# Altium project Pulp FMC Sensor Board_8X512Mbits_HyperRam.PrjPcb
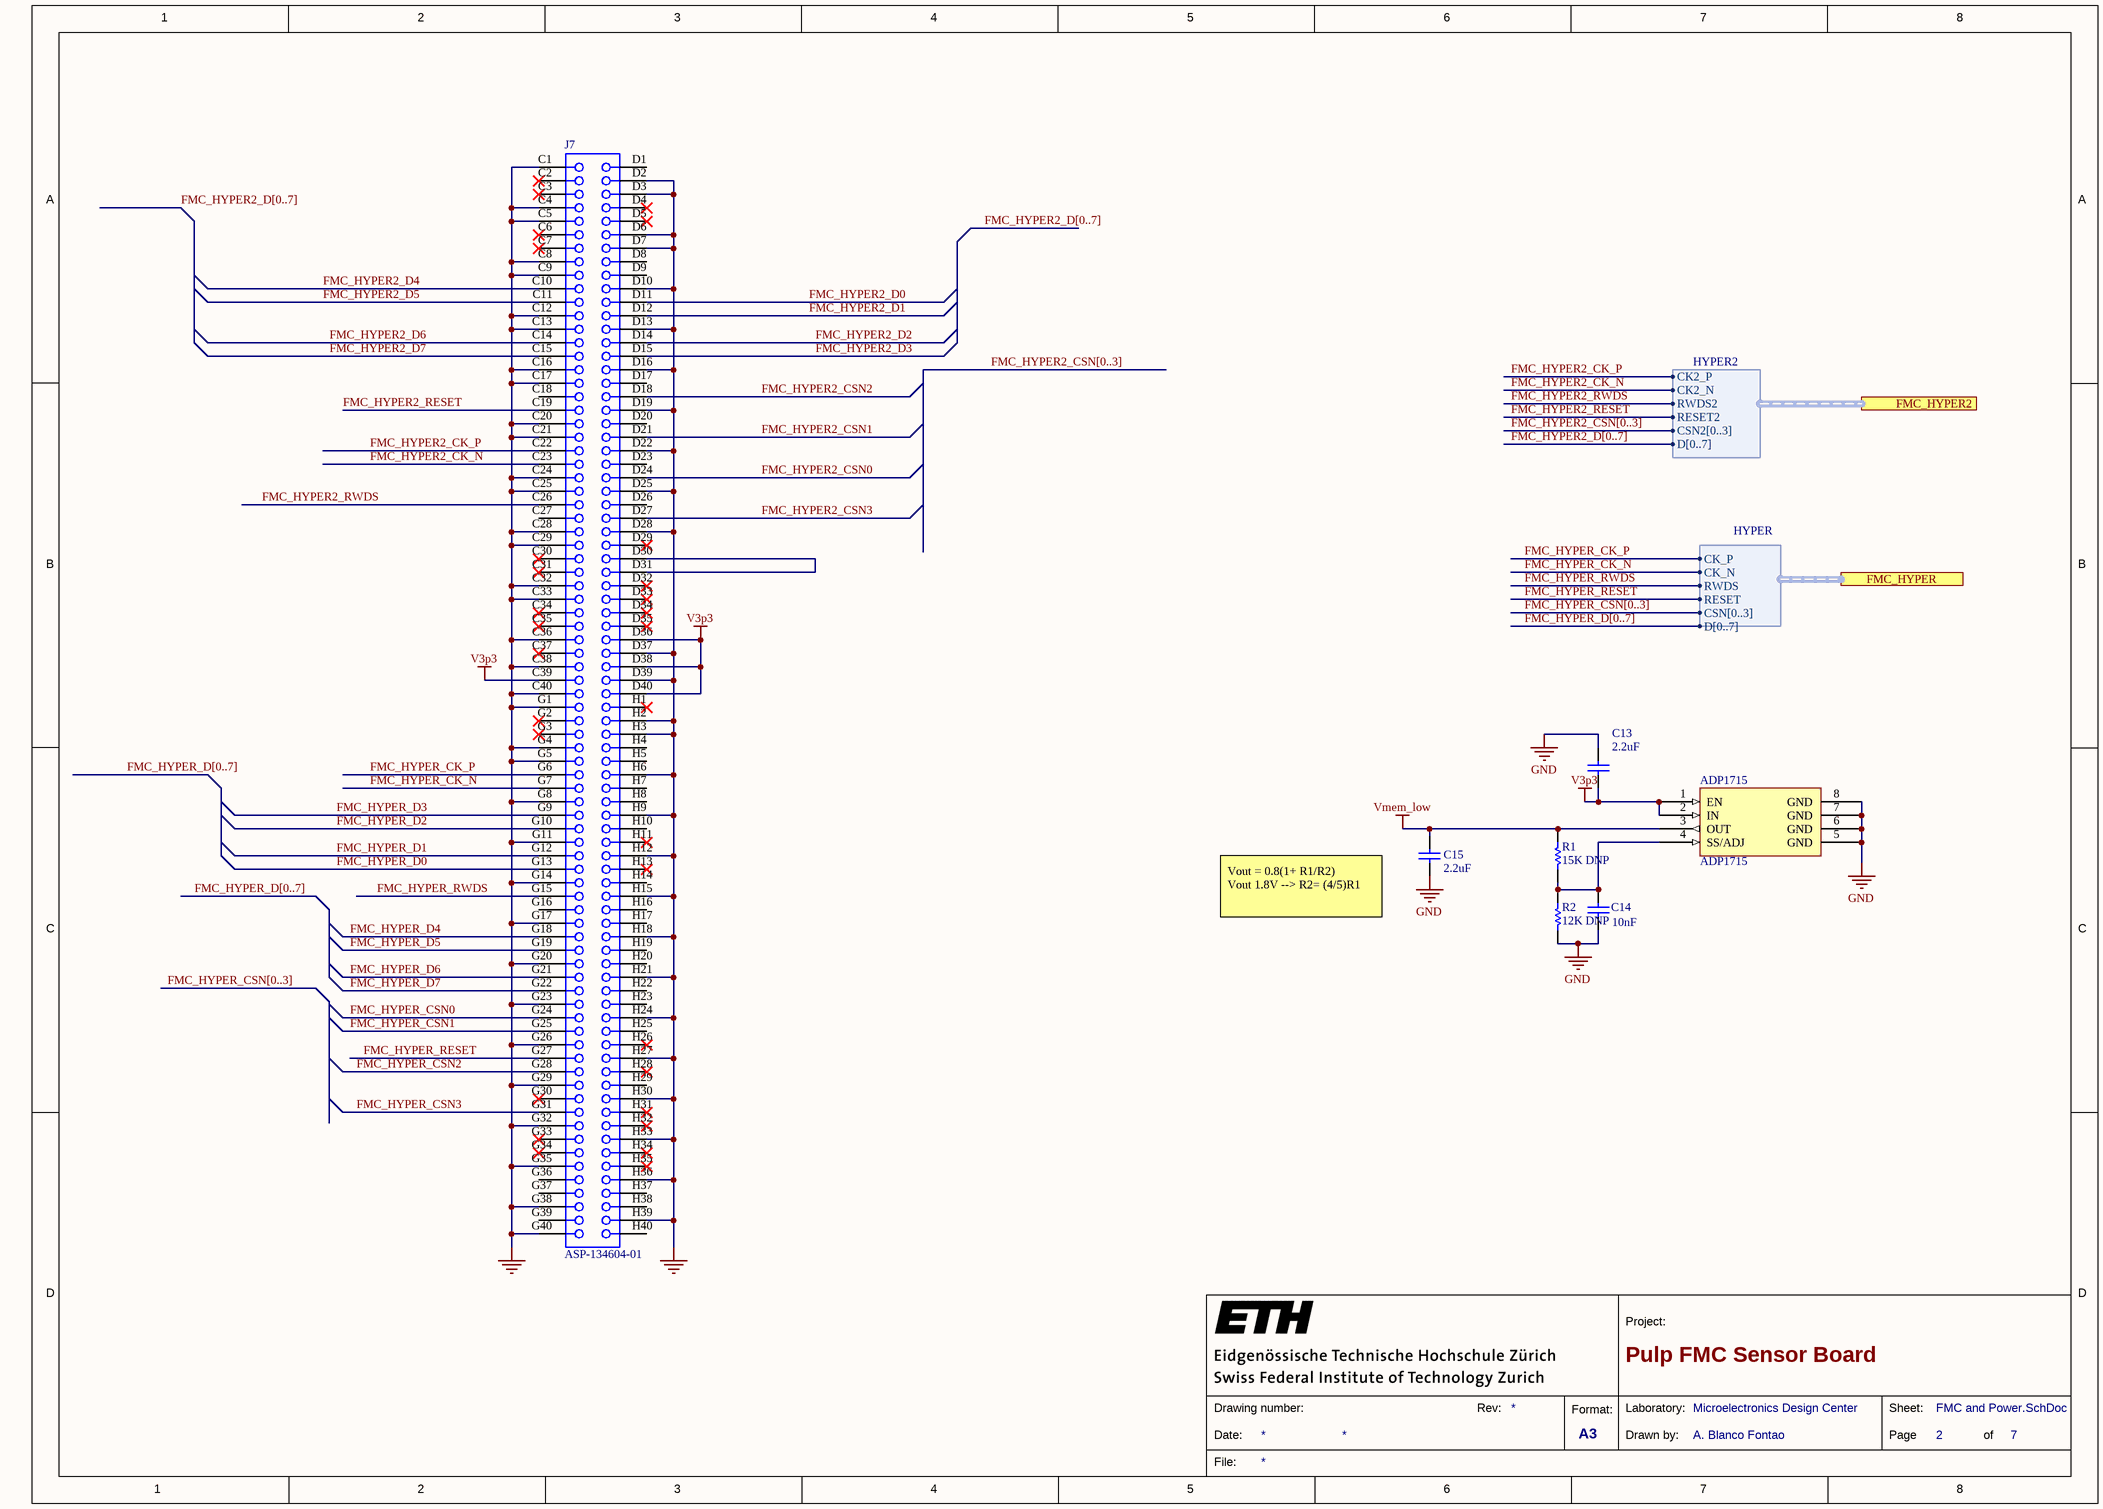
[diagram p0: FMC and Power.SchDoc]
1 sheet, 7 parts. Net scope: flat (ports and power ports of the same name join across sheets).
Board file: Pulp FMC Sensor Board_8X512Mbits_HyperRam.PcbDoc

## Sheet FMC and Power.SchDoc: Pulp FMC Sensor Board
size A3; Author: A. Blanco Fontao; CompanyName: ETHZ; DrawnBy: A. Blanco Fontao; Organization: Microelectronics Design Center; Address1: Gloriastrasse 35; Address2: 8092 Zurich; Address3: Switzerland; SheetNumber: 2; SheetTotal: 7

### Parts
ADP1715  ADP1715  [TSOP65P490X110-8N]
C13  value 2.2uF  [0402-A]  (hidden comment: Cap Semi)
C14  value 10nF  [0402-A]  (hidden comment: Cap Semi)
C15  value 2.2uF  [0402-A]  (hidden comment: Cap Semi)
J7  ASP-134604-01  [ASP-134604-01]
R1  value 15K DNP  [RESC0603(1608)_N]  (hidden comment: 15K 5% 0603(1608))
R2  value 12K DNP  [RESC0603(1608)_N]  (hidden comment: 12K 5% 0603(1608))

### Ports
FMC_HYPER2 (harness HYPER2), FMC_HYPER (harness HYPER)

### Harnesses
HYPER2: D[0..7], CK2_P, CK2_N, RWDS2, CSN2[0..3], RESET2
HYPER: CK_N, CK_P, RWDS, CSN[0..3], D[0..7], RESET

### Nets
GND: ADP1715.5(GND) ADP1715.6(GND) ADP1715.7(GND) ADP1715.8(GND) C13.1 C14.2 C15.2 J7.C1 J7.C4 J7.C5 J7.C8 J7.C9 J7.C12 J7.C13 J7.C16 J7.C17 J7.C20 J7.C21 J7.C24 J7.C25 J7.C28 J7.C29 J7.C32 J7.C33 J7.C36 J7.C38 J7.C40 J7.D2 J7.D3 J7.D6 J7.D7 J7.D10 J7.D13 J7.D16 J7.D19 J7.D22 J7.D25 J7.D28 J7.D37 J7.D39 J7.G1 J7.G4 J7.G5 J7.G8 J7.G11 J7.G14 J7.G17 J7.G20 J7.G23 J7.G26 J7.G29 J7.G32 J7.G35 J7.G38 J7.G40 J7.H2 J7.H3 J7.H6 J7.H9 J7.H12 J7.H15 J7.H18 J7.H21 J7.H24 J7.H27 J7.H30 J7.H33 J7.H36 J7.H39 R2.1
V3p3: ADP1715.1(EN) ADP1715.2(IN) C13.2 J7.C39 J7.D36 J7.D38 J7.D40
Vmem_low: ADP1715.3(OUT) C15.1 R1.2
FMC_HYPER2_CK_N: J7.C23 ; port FMC_HYPER2.CK2_N
FMC_HYPER2_CK_P: J7.C22 ; port FMC_HYPER2.CK2_P
FMC_HYPER2_CSN0: J7.D24
FMC_HYPER2_CSN1: J7.D21
FMC_HYPER2_CSN2: J7.D18
FMC_HYPER2_CSN3: J7.D27
FMC_HYPER2_D0: J7.D11
FMC_HYPER2_D1: J7.D12
FMC_HYPER2_D2: J7.D14
FMC_HYPER2_D3: J7.D15
FMC_HYPER2_D4: J7.C10
FMC_HYPER2_D5: J7.C11
FMC_HYPER2_D6: J7.C14
FMC_HYPER2_D7: J7.C15
FMC_HYPER2_RESET: J7.C19 ; port FMC_HYPER2.RESET2
FMC_HYPER2_RWDS: J7.C26 ; port FMC_HYPER2.RWDS2
FMC_HYPER_CK_N: J7.G7 ; port FMC_HYPER.CK_N
FMC_HYPER_CK_P: J7.G6 ; port FMC_HYPER.CK_P
FMC_HYPER_CSN0: J7.G24
FMC_HYPER_CSN1: J7.G25
FMC_HYPER_CSN2: J7.G28
FMC_HYPER_CSN3: J7.G31
FMC_HYPER_D0: J7.G13
FMC_HYPER_D1: J7.G12
FMC_HYPER_D2: J7.G10
FMC_HYPER_D3: J7.G9
FMC_HYPER_D4: J7.G18
FMC_HYPER_D5: J7.G19
FMC_HYPER_D6: J7.G21
FMC_HYPER_D7: J7.G22
FMC_HYPER_RESET: J7.G27 ; port FMC_HYPER.RESET
FMC_HYPER_RWDS: J7.G15 ; port FMC_HYPER.RWDS
NetADP1715_4: ADP1715.4(SS/ADJ) C14.1 R1.1 R2.2
NetJ7_D30: J7.D30 J7.D31

Not connected (* = marked no-connect by the designer): J7 C2* C3* C6* C7* C18 C27 C30* C31* C34* C35* C37* D1 D4* D5* D8 D9 D17 D20 D23 D26 D29* D32* D33* D34* D35* G2* G3* G16 G30* G33* G34* G36 G37 G39 H1* H4 H5 H7 H8 H10 H11* H13* H14 H16 H17 H19 H20 H22 H23 H25 H26* H28* H29 H31* H32* H34* H35* H37 H38 H40

### Buses and harness runs
bus FMC_HYPER2_CSN[0..3]
bus FMC_HYPER2_D[0..7]
bus FMC_HYPER_CSN[0..3]
bus FMC_HYPER_D[0..7]

### Notes on the sheet
- (near C15) Vout = 0.8(1+ R1/R2)
  Vout 1.8V --> R2= (4/5)R1
- 1
- 2
- 3
- 4
- 5
- 6
- 7
- 8
- A
- B
- C
- D
- Project:
- Date:
- Drawing number:
- Rev:
- Format:
- A3
- Drawn by:
- Laboratory:
- Page
- Sheet:
- of
- File:

### Library data of the parts
C13-C15 = Cap Semi: Capacitor (Semiconductor SIM Model); Published: 8-Jun-2000; LatestRevisionDate: 29-May-2009; LatestRevisionNote: IPC-7351 Footprint Added.; PackageReference: C1206; Publisher: Altium Limited; PackageDescription: Chip Capacitor
J7 = CMP-00488-1: Conn Array Terminal FMC Male SKT 160 POS 1.27mm Solder ST SMD; Manufacturer: Samtec; Number of arrays: 4; Number of poles: 160; Pitch: 1.27mm; Product type: SKT; Width: 14.68mm; Wire connection method: Solder; Length: 55.78mm; Manufacturer Part Number: ASP-134604-01; Supplier: Digikey; Supplier Part Number: SAM8732-ND; ComponentLink1Description: asp-134604-01-9532665.pdf; ComponentLink1URL: https://datasheet.ciiva.com/9532/asp-134604-01-9532665.pdf; ComponentLink2Description: asp-134604-01-403751.pdf; ComponentLink2URL: https://datasheet.ciiva.com/403/asp-134604-01-403751.pdf
R1 = CMP-1012-00098-1: 15K 0.1W 5% 0603 (1608 Metric)  SMD; Case-EIA: 0603; Case-Metric: 1608; Technology: SMT; Tolerance: 5 %; Power: 0.1 W
R2 = CMP-1012-00098-1: 12K 0.1W 5% 0603 (1608 Metric)  SMD; Case-EIA: 0603; Case-Metric: 1608; Technology: SMT; Tolerance: 5 %; Power: 0.1 W